# Altium schematic sheet Temperature_Sensor.SchDoc: Printer
size 431 x 279 mm; Date: 2022; Author: Renaissance; CompanyName: Upenn-ESE516; DrawnBy: Xinyang Tan;  Yuxin Wang; Engineer: Xinyang Tan;  Yuxin Wang; Address1: 200 S 33 St; Address2: Moore Building, Rm 101; Address3: Philadephla, PA 19104; DocumentNumber: 8; Revision: 1.0; SheetNumber: 8; SheetTotal: 9
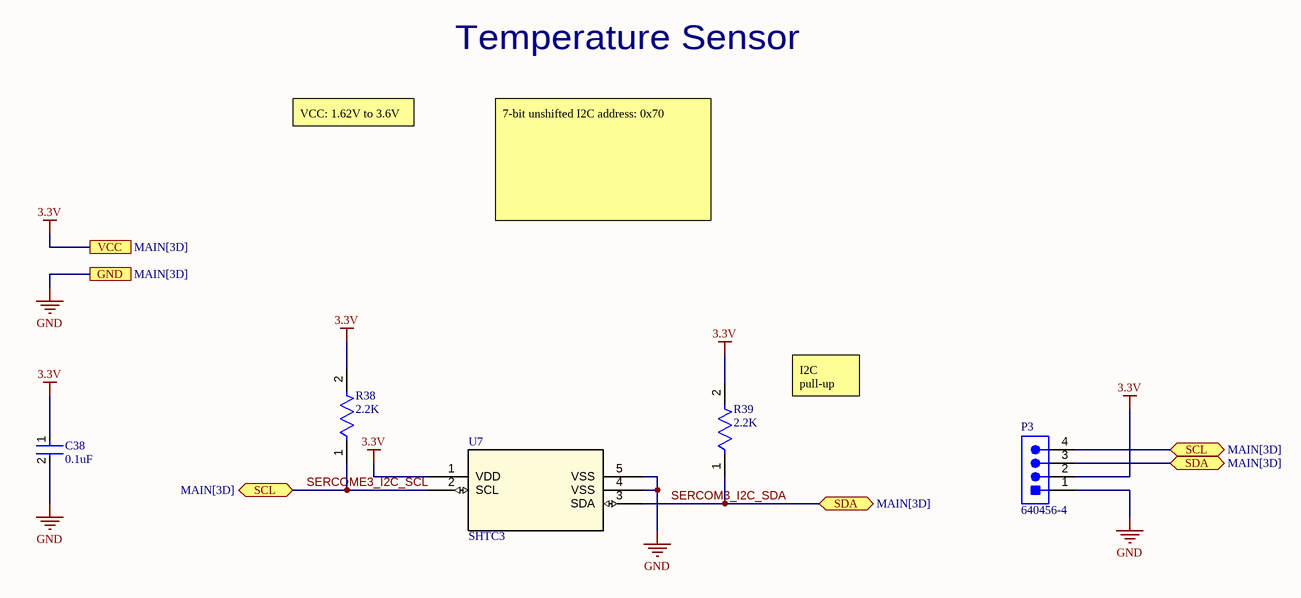
[diagram p0: Temperature_Sensor.SchDoc]

## Parts
C38  0.1uF  [FP-C0402-BB-MFG]
P3  640456-4  [TECO-640456-4]
R38  2.2K  [FP-SR0402-MFG]
R39  2.2K  [FP-SR0402-MFG]
U7  SHTC3  [SHTC3_SEN]

## Ports
GND (see MAIN[3D]), SCL (bidir, see MAIN[3D]), SDA (bidir, see MAIN[3D]), VCC (see MAIN[3D])

## Nets
3.3V: C38.1 P3.2 R38.2 R39.2 U7.1(VDD) ; port VCC
GND: C38.2 P3.1 U7.4(VSS) U7.5(VSS) ; port GND
SERCOM3_I2C_SDA: P3.3 R39.1 U7.3(SDA) ; port SDA
SERCOME3_I2C_SCL: P3.4 R38.1 U7.2(SCL) ; port SCL

## Notes on the sheet
- Temperature Sensor
- VCC: 1.62V to 3.6V
- 7-bit unshifted I2C address: 0x70
- I2C
  pull-up
- DWG. NO.
- REV.
- SHT.
- THIS DOCUMENT AND THE DATA DISCLOSED HEREIN OR HEREWITH IS THE PROPERTY OF ALTIUM LIMITED AND MAY BE FREELY DISTRIBUTED IN WHOLE. NO RIGHTS ARE RESERVED OR EXPRESS OR IMPLIED WARANTEE GIVEN.
- REVISION
- DESCRIPTION
- DATE
- APPROVED
- ENG:
- APPROVALS
- PROJECT
- DSN:
- CHK:
- REFERENCE DOCUMENTS
- PROJECT REVISION:
- TITLE
- DOCUMENT REVISION:
- DESIGN ITEM:
- BOM:
- FAB DWG:
- PCB DWG:
- ASSY DWG:
- SCALE:
- SIZE
- B
- CAGE CODE
- FILE NAME
- DWG NO.
- SHEET
- OF
- REV

## Library data of the parts
C38 = CMP-03020-010956-2: CAP CER 0402 0.1UF 16V X7R 20% A; Manufacturer Part Number: C0402C104M4RACAUTO; Manufacturer: Kemet; Temperature Coefficient: 15%; Tolerance: 0.2; Capacitance: 0.10 μF; Material: Ceramic; Value: 0.10 μF; Octopart: https://octopart.com/c0402c104m4racauto-kemet-75357841; Device Class L3: Ceramic Capacitors; Lead Free: Yes; Package: C0402-BB; Digikey Description: CAP CER 0402 0.1UF 16V X7R 20% A; ComponentLink2Description: Datasheet; Category: Cap; Height: 0.55mm; Device Class L2: Capacitors; Automotive: No; Voltage Rating: 16 V; Device Class L1: Passive Components; Ipc Land Pattern Name: CAPC10050X50; RoHS: TRUE; Temperature Range Low: -55°C; ComponentLink2URL: https://content.kemet.com/datasheets/KEM_C1002_X7R_SMD.pdf; Temperature Characteristic: X7R; Temperature: -55°C to +125°C; Temperature Range High: +125°C
P3 = CMP-2000-05419-1: Male Header, Pitch 2.54 mm, 1 x 4 Position, Height 10.03 mm, Tail Length 3.56 mm, RoHS, Bulk; Manufacturer: TE Connectivity; Material, Housing: Polyester; Primary Type: InterconnectSystem; Mount Angle: Vertical; Color, Housing: White; Current, Rating: 5 / A; Agency Approvals: CSA,UL; Contact Termination Area Plating: Tin; Temperature, Operating: -55to+105 / degC; Standards: RoHSCompliant,ELVCompliant,UL94V-0; Number of Positions: 4; Brand/Series: MTA-100Series; Angle: Straight; Pin Spacing: 0.1 / "; Material, Contact: CopperAlloy; Connector Type: MTA-100; Special Features: Pinstrip; Mounting Hole Size: 0.04 / "; Contact Centerline Spacing: 0.100 / in.; Voltage, Rating: 250 / V; Manufacturer URL: http://www.te.com/; Length, Pin: 0.14 / "; Length, Overall: 0.4 / "; Color: White; Flammability Rating: UL94V-0; Mounting Type: PCMount; Termination: Solder; Datasheet URL: https://datasheet.ciiva.com/16286/eng-ds-82056-mta-0608-16286228.pdf; Number of Contacts: 4; Contact Shape: Square; Contact Mating Area Plating: Tin; Length, Terminal Post: 0.14 / in.; Size, Post: 0.025 / in.; Contact Plating: Tin; Type: PCBPlug; Datasheet Version: Dec-14; Number of Rows: 1
R38 R39 = CMP-03412-030683-1: RES 2.2K OHM 1% 1/5W 0402; Manufacturer Part Number: SR0402FR-7T2K2L; Manufacturer: Yageo; Value: 2.2KΩ; Tolerance: 0.01; Automotive Grade: Grade 0; Power Rating: 0.2W; Voltage Rating: 50V; Device Class L3: Chip SMD Resistors; Category: Res; RoHS: TRUE; Digikey Description: RES 2.2K OHM 1% 1/5W 0402; Ipc Land Pattern Name: RESC10050X35; Height: 0.4mm; Temperature: -55°C to +155°C; Composition: Thick Film; ComponentLink2URL: http://www.yageo.com/documents/recent/PYu-SR_D_F%20tol_RoHS_L_3.pdf; Octopart: https://octopart.com/sr0402fr-7t2k2l-yageo-92673847; Footprint Url: http://www.yageo.com/exep/pages/download/literatures/PYu-R_Mount_10.pdf; Automotive: Yes; Temperature Range High: +155°C; ComponentLink2Description: Datasheet; Device Class L2: Resistors; Resistance: 2.2KΩ; Lead Free: Yes; Series: SR; Device Class L1: Passive Components; Temperature Range Low: -55°C; Package: SR0402
U7 = SHTC3: No Description Available; Mfr_Name: Sensirion; Copyright: Copyright (C) 2022 Ultra Librarian. All rights reserved.; Manufacturer_Part_Number: SHTC3; Digi-Key_Part_Number_1: 1649-1100-1-ND; Digi-Key_Part_Number_2: 1649-1100-2-ND; Digi-Key_Part_Number_3: 1649-1100-6-ND; Digi-Key_Part_Number_4: 1649-1105-1-ND; Digi-Key_Part_Number_5: 1649-1105-2-ND; Digi-Key_Part_Number_6: 1649-1105-6-ND; RefDes: RefDes; Type: DEV